# Altium project PCB_practice.PrjPcb
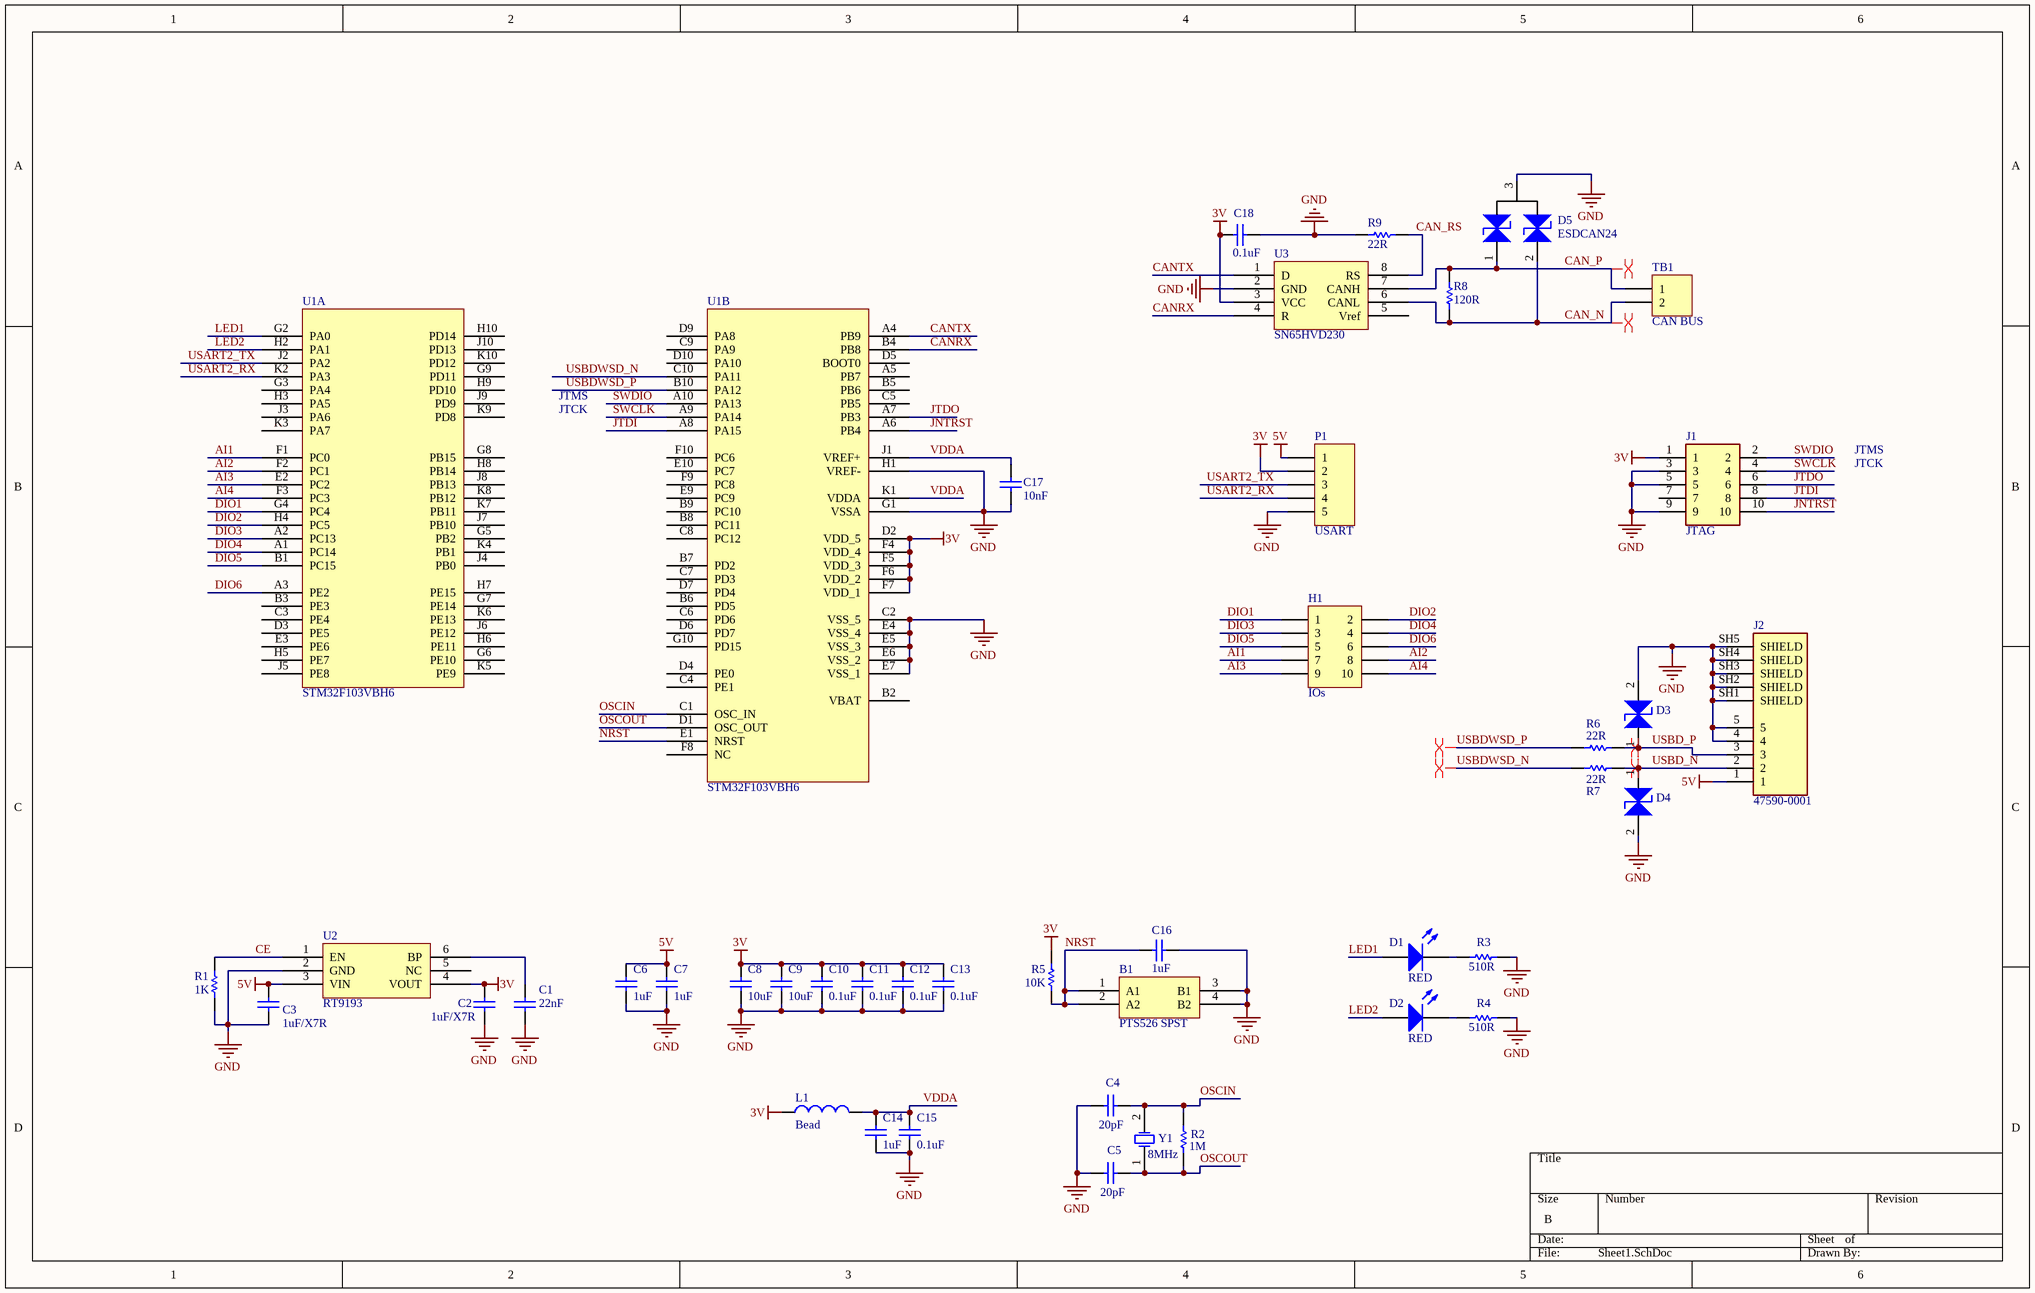
[diagram p0: Sheet1.SchDoc]
1 sheet, 43 parts. Net scope: global (net labels, ports and power ports of the same name join across sheets).
Board file: PCB1.PcbDoc

## Sheet Sheet1.SchDoc
size B

### Parts
B1  PTS526 SPST  [PTS526 SPST]
C1  value 22nF  [0603]  (hidden comment: Cap)
C2  value 1uF/X7R  [0603]  (hidden comment: Cap)
C3  value 1uF/X7R  [0603]  (hidden comment: Cap)
C4  value 20pF  [0603]  (hidden comment: Cap)
C5  value 20pF  [0603]  (hidden comment: Cap)
C6  value 1uF  [0603]  (hidden comment: Cap)
C7  value 1uF  [0603]  (hidden comment: Cap)
C8  value 10uF  [0603]  (hidden comment: Cap)
C9  value 10uF  [0603]  (hidden comment: Cap)
C10  value 0.1uF  [0603]  (hidden comment: Cap)
C11  value 0.1uF  [0603]  (hidden comment: Cap)
C12  value 0.1uF  [0603]  (hidden comment: Cap)
C13  value 0.1uF  [0603]  (hidden comment: Cap)
C14  value 1uF  [0603]  (hidden comment: Cap)
C15  value 0.1uF  [0603]  (hidden comment: Cap)
C16  value 1uF  [0603]  (hidden comment: Cap)
C17  value 10nF  [0603]  (hidden comment: Cap)
C18  value 0.1uF  [0603]  (hidden comment: Cap)
D1  RED  [0603]
D2  RED  [0603]
D3  TVS  [SOD323]  (value not drawn)
D4  TVS  [SOD323]  (value not drawn)
D5  ESDCAN24  [SOT-23]
H1  IOs  [5X2 HEADER 1.27mm]
J1  JTAG  [SAMTEC_FTSH-105-01-L-DV-K]
J2  47590-0001  [MOLEX_47590-0001]
L1  value Bead  [0603]  (hidden comment: Inductor)
P1  USART  [5 Pin header 1.27mm]
R1  value 1K  [0603]  (hidden comment: Res1)
R2  value 1M  [0603]  (hidden comment: Res1)
R3  value 510R  [0603]  (hidden comment: Res1)
R4  value 510R  [0603]  (hidden comment: Res1)
R5  value 10K  [0603]  (hidden comment: Res1)
R6  value 22R  [0603]  (hidden comment: Res1)
R7  value 22R  [0603]  (hidden comment: Res1)
R8  value 120R  [0603]  (hidden comment: Res1)
R9  value 22R  [0603]  (hidden comment: Res1)
TB1  CAN BUS  [Terminal Block 3.5mm]
U1  STM32F103VBH6  [LFBGA100 10x10]  (parts A,B of 2)
U2  RT9193  [WDFN-6L]
U3  SN65HVD230  [SOIC 8 1.27mm]
Y1  8MHz  [HC-49/US]

### Nets
3V: C2.1 C8.1 C9.1 C10.1 C11.1 C12.1 C13.1 C18.1 J1.1 L1.1 P1.2 R5.1 U1.D2(VDD_5) U1.F4(VDD_4) U1.F5(VDD_3) U1.F6(VDD_2) U1.F7(VDD_1) U2.4(VOUT) U3.3(VCC)
5V: C3.1 C6.1 C7.1 J2.1 P1.1 U2.3(VIN)
GND: B1.3(B1) B1.4(B2) C1.2 C2.2 C3.2 C4.1 C5.1 C6.2 C7.2 C8.2 C9.2 C10.2 C11.2 C12.2 C13.2 C14.2 C15.2 C16.2 C17.1 C18.2 D3.2(K24) D4.2(K24) D5.3(K23) J1.3 J1.5 J1.9 J2.4 J2.5 J2.SH1(SHIELD) J2.SH2(SHIELD) J2.SH3(SHIELD) J2.SH4(SHIELD) J2.SH5(SHIELD) P1.5 R1.1 R3.2 R4.2 R9.2 U1.C2(VSS_5) U1.E4(VSS_4) U1.E5(VSS_3) U1.E6(VSS_2) U1.E7(VSS_1) U1.G1(VSSA) U1.H1(VREF-) U2.2(GND) U3.2(GND)
AI1: H1.7 U1.F1(PC0)
AI2: H1.8 U1.F2(PC1)
AI3: H1.9 U1.E2(PC2)
AI4: H1.10 U1.F3(PC3)
CAN_N: D5.2(K23) R8.1 TB1.2 U3.6(CANL)
CAN_P: D5.1(K23) R8.2 TB1.1 U3.7(CANH)
CAN_RS: R9.1 U3.8(RS)
CANRX: U1.B4(PB8) U3.4(R)
CANTX: U1.A4(PB9) U3.1(D)
CE: R1.2 U2.1(EN)
DIO1: H1.1 U1.G4(PC4)
DIO2: H1.2 U1.H4(PC5)
DIO3: H1.3 U1.A2(PC13)
DIO4: H1.4 U1.A1(PC14)
DIO5: H1.5 U1.B1(PC15)
DIO6: H1.6 U1.A3(PE2)
JNTRST: J1.10 U1.A6(PB4)
JTDI: J1.8 U1.A8(PA15)
JTDO: J1.6 U1.A7(PB3)
LED1: D1.1(A) U1.G2(PA0)
LED2: D2.1(A) U1.H2(PA1)
NRST: B1.1(A1) B1.2(A2) C16.1 R5.2 U1.E1(NRST)
OSCIN: C4.2 R2.2 U1.C1(OSC_IN) Y1.2(OSC2)
OSCOUT: C5.2 R2.1 U1.D1(OSC_OUT) Y1.1(OSC1)
SWCLK: J1.4 U1.A9(PA14)
SWDIO: J1.2 U1.A10(PA13)
USART2_RX: P1.4 U1.K2(PA3)
USART2_TX: P1.3 U1.J2(PA2)
USBD_N: D4.1(K23) J2.2 R7.2
USBD_P: D3.1(K23) J2.3 R6.2
USBDWSD_N: R7.1 U1.C10(PA11)
USBDWSD_P: R6.1 U1.B10(PA12)
VDDA: C14.1 C15.1 C17.2 L1.2 U1.J1(VREF+) U1.K1(VDDA)
NetC1_1: C1.1 U2.6(BP)
NetD1_2: D1.2(K) R3.1
NetD2_2: D2.2(K) R4.1

Not connected (* = marked no-connect by the designer): J1 7; U1 A5(PB7) B2(VBAT) B3(PE3) B5(PB6) B6(PD5) B7(PD2) B8(PC11) B9(PC10) C3(PE4) C4(PE1) C5(PB5) C6(PD6) C7(PD3) C8(PC12) C9(PA9) D3(PE5) D4(PE0) D5(BOOT0) D6(PD7) D7(PD4) D9(PA8) D10(PA10) E3(PE6) E9(PC9) E10(PC7) F8(NC) F9(PC8) F10(PC6) G3(PA4) G5(PB2) G6(PE10) G7(PE14) G8(PB15) G9(PD11) G10(PD15) H3(PA5) H5(PE7) H6(PE11) H7(PE15) H8(PB14) H9(PD10) H10(PD14) J3(PA6) J4(PB0) J5(PE8) J6(PE12) J7(PB10) J8(PB13) J9(PD9) J10(PD13) K3(PA7) K4(PB1) K5(PE9) K6(PE13) K7(PB11) K8(PB12) K9(PD8) K10(PD12); U2 5(NC); U3 5(Vref)

### Layout directives
differential pair: CAN_N, CAN_P, USBD_N, USBD_P, USBDWSD_N, USBDWSD_P

### Notes on the sheet
- JTCK
- JTMS

### Library data of the parts
C1-C18 = Cap: Capacitor; Published: 8-Jun-2000; LatestRevisionDate: 17-Jul-2002; LatestRevisionNote: Re-released for DXP Platform.; PackageReference: RAD-0.3; Publisher: Altium Limited; PackageDescription: Radial Cap, Thru-Hole; 2 Leads; 0.3 in Pin Spacing
D1 D2 = LED2: Typical RED, GREEN, YELLOW, AMBER GaAs LED; Published: 8-Jun-2000; LatestRevisionDate: 17-Jul-2002; LatestRevisionNote: Re-released for DXP Platform.; PackageVersion: Feb-2002; PackageReference: 3.2X1.6X1.1; Publisher: Altium Limited; PackageDescription: SM LED; 2 Flat Leads
H1 = Header 5X2: Header, 5-Pin, Dual row; LatestRevisionDate: 17-Jul-2002; LatestRevisionNote: Re-released for DXP Platform.; Publisher: Altium Limited
J1 = FTSH-105-01-L-DV-K: Connector Header Surface Mount 10 position 0.050 _1.27mm_; MF: Samtec; SnapEDA_Link: https://www.snapeda.com/parts/FTSH-105-01-L-DV-K/Samtec%20Inc./view-part/37894/?ref=snap; Value: *; MP: FTSH-105-01-L-DV-K; Package: TSSOP-20 Texas Instruments; Price: None; Availability: Unavailable
J2 = 47590-0001: USB - micro AB Receptacle Connector 5 Position Surface Mount, Right Angle; Through Hole; MF: Molex; SnapEDA_Link: https://www.snapeda.com/parts/47590-0001/Molex/view-part/47491/?ref=snap; Value: *; Price: None; Availability: Unavailable; MP: 47590-0001; Package: None
L1 = Inductor: Code_IEC: 1005; Published: 8-Jun-2000; LatestRevisionDate: 29-May-2009; LatestRevisionNote: IPC-7351 Footprint Added.; PackageReference: 0402-A; Publisher: Altium Limited; PackageDescription: Chip Inductor; Code_JEITA: 0402
P1 = Header 5: Header, 5-Pin; LatestRevisionDate: 17-Jul-2002; LatestRevisionNote: Re-released for DXP Platform.; Publisher: Altium Limited
R1-R9 = Res1: Resistor; Published: 8-Jun-2000; LatestRevisionDate: 17-Jul-2002; LatestRevisionNote: Re-released for DXP Platform.; PackageReference: AXIAL-0.3; Publisher: Altium Limited; PackageDescription: Axial Device, Thru-Hole; 2 Leads; 0.3 in Pin Spacing
TB1 = Header 2: Header, 2-Pin; LatestRevisionDate: 17-Jul-2002; LatestRevisionNote: Re-released for DXP Platform.; Publisher: Altium Limited
Y1 = XTAL: Crystal Oscillator; Published: 8-Jun-2000; LatestRevisionDate: 17-Jul-2002; LatestRevisionNote: Re-released for DXP Platform.; PackageReference: R38; Publisher: Altium Limited; PackageDescription: Crystal, Thru-Hole; 2 Leads; Body 3.1 x 8.2 mm (Dia.xH)